# Altium schematic sheet PCIe_Connector.SchDoc: Grandmaster PCIe & JTAG Connectors
size A; Author: N Smith; Revision: A; SheetNumber: 3; SheetTotal: 11; Customer: 01910
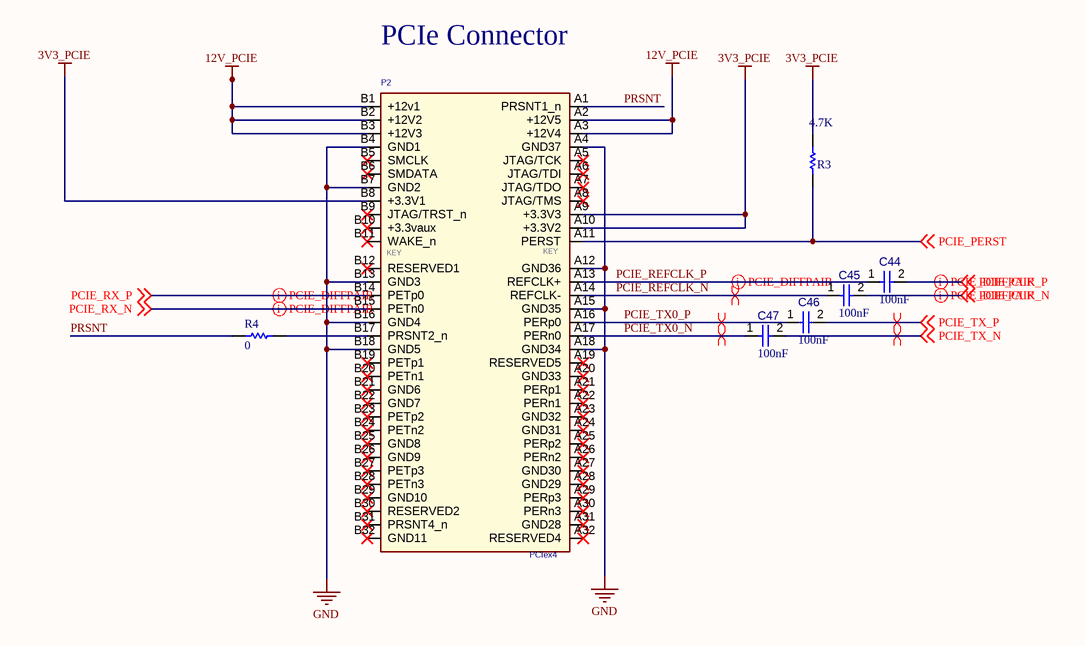
[diagram p0: PCIe_Connector.SchDoc]

## Parts
C44  value 100nF  [CAPC1005X56X25LL10T15]  (hidden comment: Capacitor 0.1 uF +/- 5% 16 V 0402)
C45  value 100nF  [CAPC1005X56X25LL10T15]  (hidden comment: Capacitor 0.1 uF +/- 5% 16 V 0402)
C46  value 100nF  [CAPC1005X56X25LL10T15]  (hidden comment: Capacitor 0.1 uF +/- 5% 16 V 0402)
C47  value 100nF  [CAPC1005X56X25LL10T15]  (hidden comment: Capacitor 0.1 uF +/- 5% 16 V 0402)
P2  PCIex4  [PCIE_4LANE_EDGE]  (no BOM)
R3  4.7K  [RESC1005X40X25LL05T05]
R4  value 0  [RESC1005X40X25ML05T10]  (hidden comment: Resistor 0R 0402 63 mW)

## Nets
3V3_PCIE: P2.A9(+3.3V3) P2.A10(+3.3V2) P2.B8(+3.3V1) R3.2
12V_PCIE: P2.A2(+12V5) P2.A3(+12V4) P2.B1(+12v1) P2.B2(+12V2) P2.B3(+12V3)
GND: P2.A4(GND37) P2.A12(GND36) P2.A15(GND35) P2.A18(GND34) P2.B4(GND1) P2.B7(GND2) P2.B13(GND3) P2.B16(GND4) P2.B18(GND5)
PCIE_CLK_N: C45.2 ; off-sheet PCIE_CLK_N
PCIE_CLK_P: C44.2 ; off-sheet PCIE_CLK_P
PCIE_PERST: P2.A11(PERST) R3.1 ; off-sheet PCIE_PERST
PCIE_REFCLK_N: C45.1 P2.A14(REFCLK-)
PCIE_REFCLK_P: C44.1 P2.A13(REFCLK+)
PCIE_RX_N: P2.B15(PETn0) ; off-sheet PCIE_RX_N
PCIE_RX_P: P2.B14(PETp0) ; off-sheet PCIE_RX_P
PCIE_TX0_N: C47.1 P2.A17(PERn0)
PCIE_TX0_P: C46.1 P2.A16(PERp0)
PCIE_TX_N: C47.2 ; off-sheet PCIE_TX_N
PCIE_TX_P: C46.2 ; off-sheet PCIE_TX_P
PRSNT: P2.A1(PRSNT1_n) R4.1
NetP2_B17: P2.B17(PRSNT2_n) R4.2

Not connected (* = marked no-connect by the designer): P2 A5(JTAG/TCK)* A6(JTAG/TDI)* A7(JTAG/TDO)* A8(JTAG/TMS)* A19(RESERVED5)* A20(GND33)* A21(PERp1)* A22(PERn1)* A23(GND32)* A24(GND31)* A25(PERp2)* A26(PERn2)* A27(GND30)* A28(GND29)* A29(PERp3)* A30(PERn3)* A31(GND28)* A32(RESERVED4)* B5(SMCLK)* B6(SMDATA)* B9(JTAG/TRST_n)* B10(+3.3vaux)* B11(WAKE_n)* B12(RESERVED1)* B19(PETp1)* B20(PETn1)* B21(GND6)* B22(GND7)* B23(PETp2)* B24(PETn2)* B25(GND8)* B26(GND9)* B27(PETp3)* B28(PETn3)* B29(GND10)* B30(RESERVED2)* B31(PRSNT4_n)* B32(GND11)*

## Layout directives
differential pair; differential pair class PCIe: PCIE_CLK_N, PCIE_CLK_P, PCIE_REFCLK_N, PCIE_REFCLK_P, PCIE_RX_N, PCIE_RX_P, PCIE_TX0_N, PCIE_TX0_P, PCIE_TX_N, PCIE_TX_P

## Notes on the sheet
- PCIe Connector
- SHEET
- timingcard.com <http://timingcard.com>
- OF
- (in symbol PCIex4) KEY

## Library data of the parts
C44-C47 = CMP-001-00001-6: Chip Capacitor, 0.1 uF, +/- 5%, 16 V, 0402 (1005 Metric); Capacitor Type: Ceramic; Voltage Rating: 16V; Max Operating Temperature: 125°C; Min Operating Temperature: -55°C; Case/Package: 0402; Mounting Technology: SM; Pins: 2; Tolerance: 5%; RoHS Compliant: True
P2 = PCIex4: PCIE x4 Edge Connector,OrCAD Symbol,NC; Part Number: 451; Manufacturer: NA; NOTE: NC; Vendor P/N: NA; Part Type: SMT
R3 = CMP-2002-01154-4: Chip Resistor, 4.7 KOhm, +/- 1%, 0.1 W, -55 to 155 degC, 0402 (1005 Metric), RoHS, Tape and Reel; PartNumber: ERJ-2RKF4701X; Voltage Rating: 50 V; Case\/Package: 0402; Power Rating: 100 mW; Height: 0.35 mm; Mounting Technology: Surface Mount; REACH SVHC: Yes; Resistance: 4.7 KOhm; Max Operating Temperature: 155 degC; ComponentLink1Description: Manufacturer URL; ComponentLink2Description: Datasheet; Pins: 2; PackageReference: 0402; Tolerance: 1%; Case Code (Imperial): 0402; Length: 1 mm; PackageDescription: 2-Pin Surface Mount Device, Body 1 x 0.5 mm; RoHSCompliant: true; Package Quantity: 1; Radiation Hardening: No; DatasheetVersion: 04/2015; Width: 0.5 mm; Case Code (Metric): 1005; Mount: Surface Mount; ComponentLink1URL: http://www.panasonic.com/; Min Operating Temperature: -55 degC; Packaging: Cut Tape; ComponentLink2URL: http://industrial.panasonic.com/cdbs/www-data/pdf/RDA0000/AOA0000C86.pdf
R4 = CMP-009-00004-5: Chip Resistor, 0 Ohm, 0.063 W, -55 to 155 degC, 0402 (1005 Metric); Power: 63mW; Voltage Rating: 50V; Max Operating Temperature: 155°C; Pins: 2; RoHS Compliant: True; Min Operating Temperature: -55°C; Mounting Technology: SM; Case/Package: 0402